# EAGLE design PureRingMod (EAGLE 9.2.0)

## Sheet 1 of 2: Main
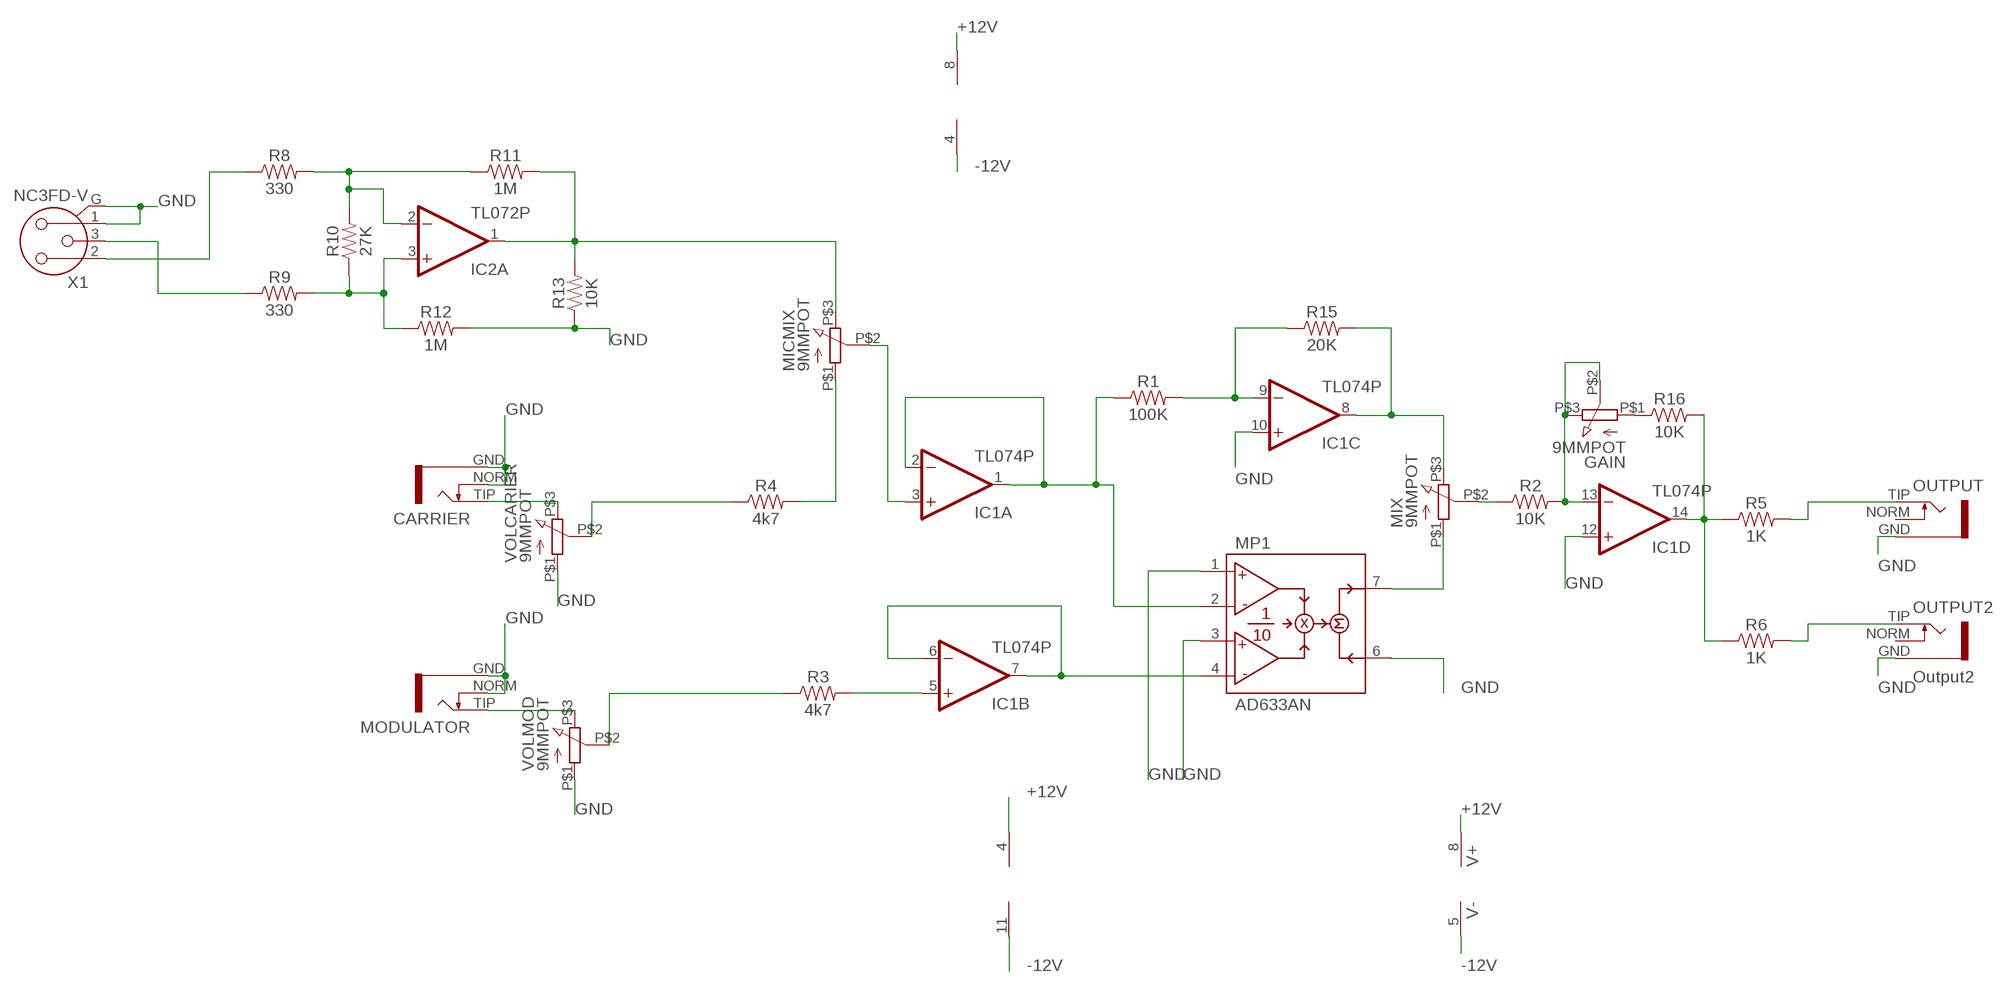
[diagram p0: schematic, sheet 1]

### Parts
CARRIER  S_JACK  [S_JACK]
GAIN  9MMPOT  [POT]
IC1  TL074P  [DIL14]
IC2  TL072P  [DIL08]
MICMIX  9MMPOT  [POT]
MIX  9MMPOT  [POT]
MODULATOR  S_JACK  [S_JACK]
MP1  AD633AN  [DIL08]
OUTPUT  S_JACK  [S_JACK]
OUTPUT2  Output2  S_JACK  [S_JACK]
R1  100K  330OHM-HORIZ-1/10W-5%  [AXIAL-0.3]
R2  10K  330OHM-HORIZ-1/10W-5%  [AXIAL-0.3]
R3  4k7  330OHM-HORIZ-1/10W-5%  [AXIAL-0.3]
R4  4k7  330OHM-HORIZ-1/10W-5%  [AXIAL-0.3]
R5  1K  330OHM-HORIZ-1/10W-5%  [AXIAL-0.3]
R6  1K  330OHM-HORIZ-1/10W-5%  [AXIAL-0.3]
R8  330  330OHM-HORIZ-1/10W-5%  [AXIAL-0.3]
R9  330  330OHM-HORIZ-1/10W-5%  [AXIAL-0.3]
R10  27K  330OHM-HORIZ-1/10W-5%  [AXIAL-0.3]
R11  1M  330OHM-HORIZ-1/10W-5%  [AXIAL-0.3]
R12  1M  330OHM-HORIZ-1/10W-5%  [AXIAL-0.3]
R13  10K  330OHM-HORIZ-1/10W-5%  [AXIAL-0.3]
R15  20K  330OHM-HORIZ-1/10W-5%  [AXIAL-0.3]
R16  10K  330OHM-HORIZ-1/10W-5%  [AXIAL-0.3]
VOLCARIER  9MMPOT  [POT]
VOLMOD  9MMPOT  [POT]
X1  NC3FD-V  [NC3FD-V]

### Nets
+12V [12V]: IC1.4(P:V+) IC2.8(P:V+) MP1.8(V+) ; also sheet 2
-12V [12V]: IC1.11(P:V-) IC2.4(P:V-) MP1.5(V-) ; also sheet 2
GND [Power]: CARRIER.GND CARRIER.NORM IC1.10(C:+IN) IC1.12(D:+IN) MODULATOR.GND MODULATOR.NORM MP1.1(X1) MP1.3(Y1) MP1.6(Z) OUTPUT2.GND OUTPUT.GND R12.P$2 R13.P$1 VOLCARIER.P$1 VOLMOD.P$1 X1.1 X1.G ; also sheet 2
N$1: IC1.1(A:OUT) IC1.2(A:-IN) MP1.2(X2) R1.P$1
N$2: IC1.6(B:-IN) IC1.7(B:OUT) MP1.4(Y2)
N$3: MIX.P$1 MP1.7(W)
N$4: IC1.8(C:OUT) MIX.P$3 R15.P$2
N$5: GAIN.P$1 R16.P$1
N$6: MIX.P$2 R2.P$1
N$7: GAIN.P$2 GAIN.P$3 IC1.13(D:-IN) R2.P$2
N$8: MICMIX.P$1 R4.P$2
N$11: IC1.5(B:+IN) R3.P$2
N$12: IC1.14(D:OUT) R5.P$1 R6.P$1 R16.P$2
N$14: IC1.9(C:-IN) R1.P$2 R15.P$1
N$15: OUTPUT.TIP R5.P$2
N$16: CARRIER.TIP VOLCARIER.P$3
N$17: MODULATOR.TIP VOLMOD.P$3
N$18: R4.P$1 VOLCARIER.P$2
N$19: R3.P$1 VOLMOD.P$2
N$20: OUTPUT2.TIP R6.P$2
N$22: R8.P$1 X1.2
N$23: R9.P$1 X1.3
N$24: IC2.2(A:-IN) R8.P$2 R10.P$2 R11.P$1
N$25: IC2.3(A:+IN) R9.P$2 R10.P$1 R12.P$1
N$27: IC2.1(A:OUT) MICMIX.P$3 R11.P$2 R13.P$2
N$30: IC1.3(A:+IN) MICMIX.P$2
Unconnected: IC2.5(B:+IN) IC2.6(B:-IN) IC2.7(B:OUT) OUTPUT2.NORM OUTPUT.NORM

## Sheet 2 of 2: Power
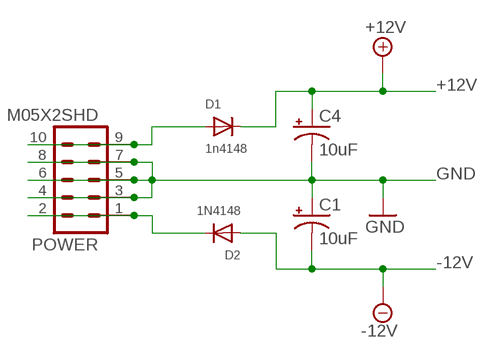
[diagram p1: schematic, sheet 2]

### Parts
C1  10uF  10UF-POLAR-RADIAL-2.5MM-25V-20%  [CPOL-RADIAL-2.5MM-5MM]
C4  10uF  10UF-POLAR-RADIAL-2.5MM-25V-20%  [CPOL-RADIAL-2.5MM-5MM]
D1  1n4148  DIODEDO-1N4148  [DO-1N4148]
D2  1N4148  DIODEDO-1N4148  [DO-1N4148]
POWER  M05X2SHD  [2X5-SHROUDED]

### Nets
+12V [12V]: C4.1(+) D1.C ; also sheet 1
-12V [12V]: C1.2(-) D2.A ; also sheet 1
GND [Power]: C1.1(+) C4.2(-) POWER.3 POWER.4 POWER.5 POWER.6 POWER.7 POWER.8 ; also sheet 1
N$9: D1.A POWER.9 POWER.10
N$10: D2.C POWER.1 POWER.2

## Library data of the parts
C1 C4 = SparkFun-Capacitors:10UF-POLAR: 10.0µF polarized capacitors A capacitor is a passive two-terminal electrical component used to store electrical energy temporarily in an electric field.; PROD_ID: CAP-08440
CARRIER MODULATOR OUTPUT OUTPUT2 = INSTRUO:S_JACK
D1 D2 = adafruit:DIODE: Diode SMADIODE - SMA Surface Mount Package 20V 1A Schottky Diode Digikey: 641-1014-6-ND DO-1N4148 - Through Hole Small Current Diode SOD-123 20V 1 A (.5mV Vf) Schottky Diode - Digikey: MBRX120TPMSCT-ND SOD-323 10V 570mA (.38mV Vf, 3ns) Schottky Diode - Digikey: ZLLS410CT-ND SOD-523 30V 30mA Schottky Diode (RB751S-40TE61) - Digikey: RB751S-40TE61CT-ND SOT23-R/W - SOT23 Package (R = Solder Paste/Reflow Ovens, W = Hand-Soldering) BAT54Film 40V 300mA - Digikey: 497-7162-1-ND
GAIN MICMIX MIX VOLCARIER VOLMOD = GMSN:9MMPOT
IC1 = GMSN:TL074: OP AMP
IC2 = GMSN-R2Project:TL072: OP AMP
MP1 = ad633-2:AD633*
POWER = SparkFun-Connectors:M05X2: Header 5x2 Standard 10-pin dual row 0.1" header. Commonly used with AVR-ISP. Use with Spark Fun Electronics SKU: PRT-00778
R1-R6 R10-R13 R15 R16 = SparkFun-Resistors:330OHM: 330Ω resistor A resistor is a passive two-terminal electrical component that implements electrical resistance as a circuit element. Resistors act to reduce current flow, and, at the same time, act to lower voltage levels within circuits. - Wikipedia; PROD_ID: RES-8371; VALUE: 330
R8 R9 = SparkFun-Resistors:330OHM: 330Ω resistor A resistor is a passive two-terminal electrical component that implements electrical resistance as a circuit element. Resistors act to reduce current flow, and, at the same time, act to lower voltage levels within circuits. - Wikipedia; PROD_ID: RES-8371
X1 = con-neutrik_ag:NC3: Neutrik Audio Connector XLR SERIES Stereo 1/4" jack Source: www.neutrik.com/; MF: FARNELL; MPN: NC3FDV; OC_FARNELL: 308869; OC_NEWARK: 07WX7308; RS-PART: 448-244

## Net classes
1 Power: width 0.35 mm
2 12V: width 0.6 mm

## Board
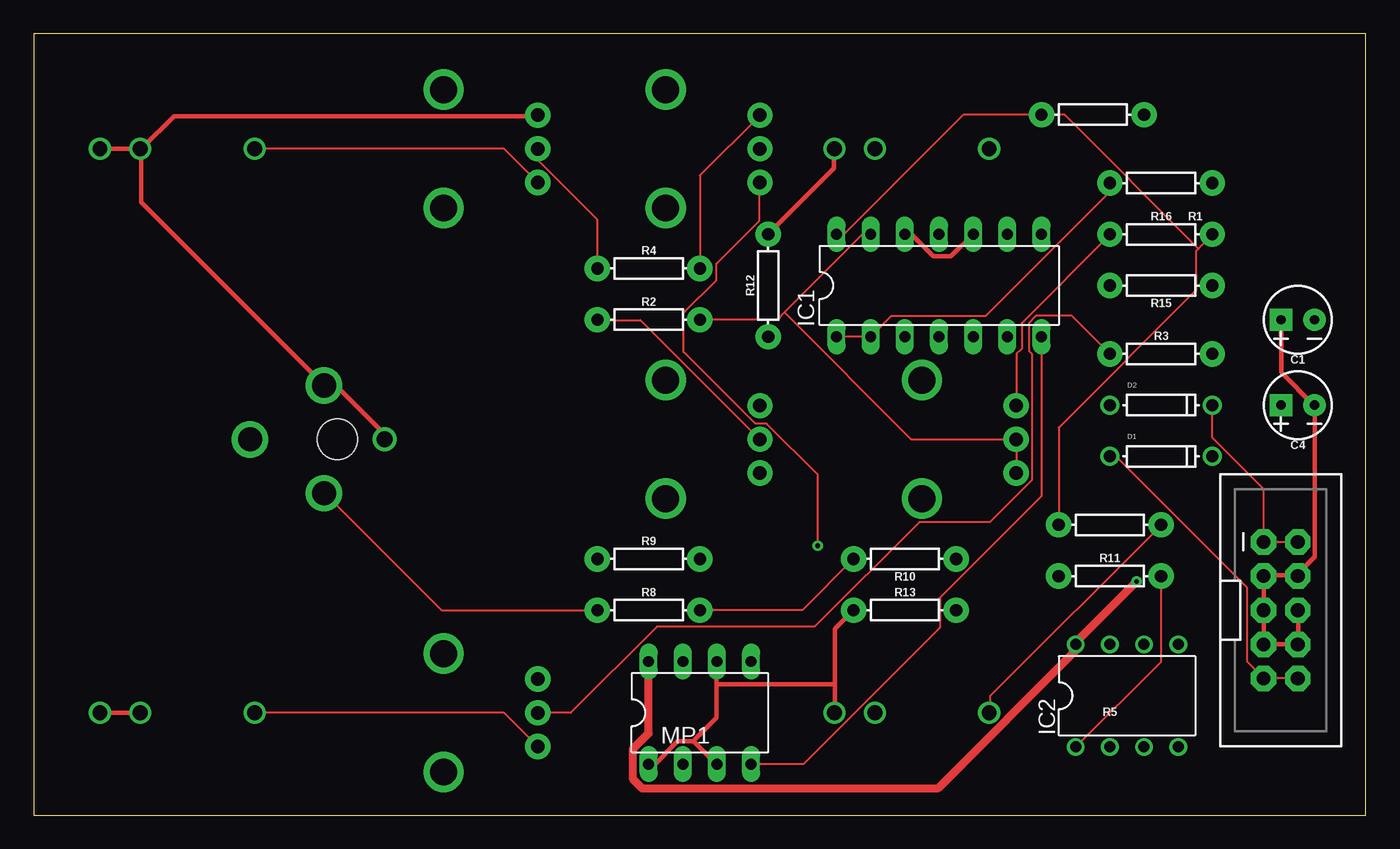
[diagram p2: board, top side]
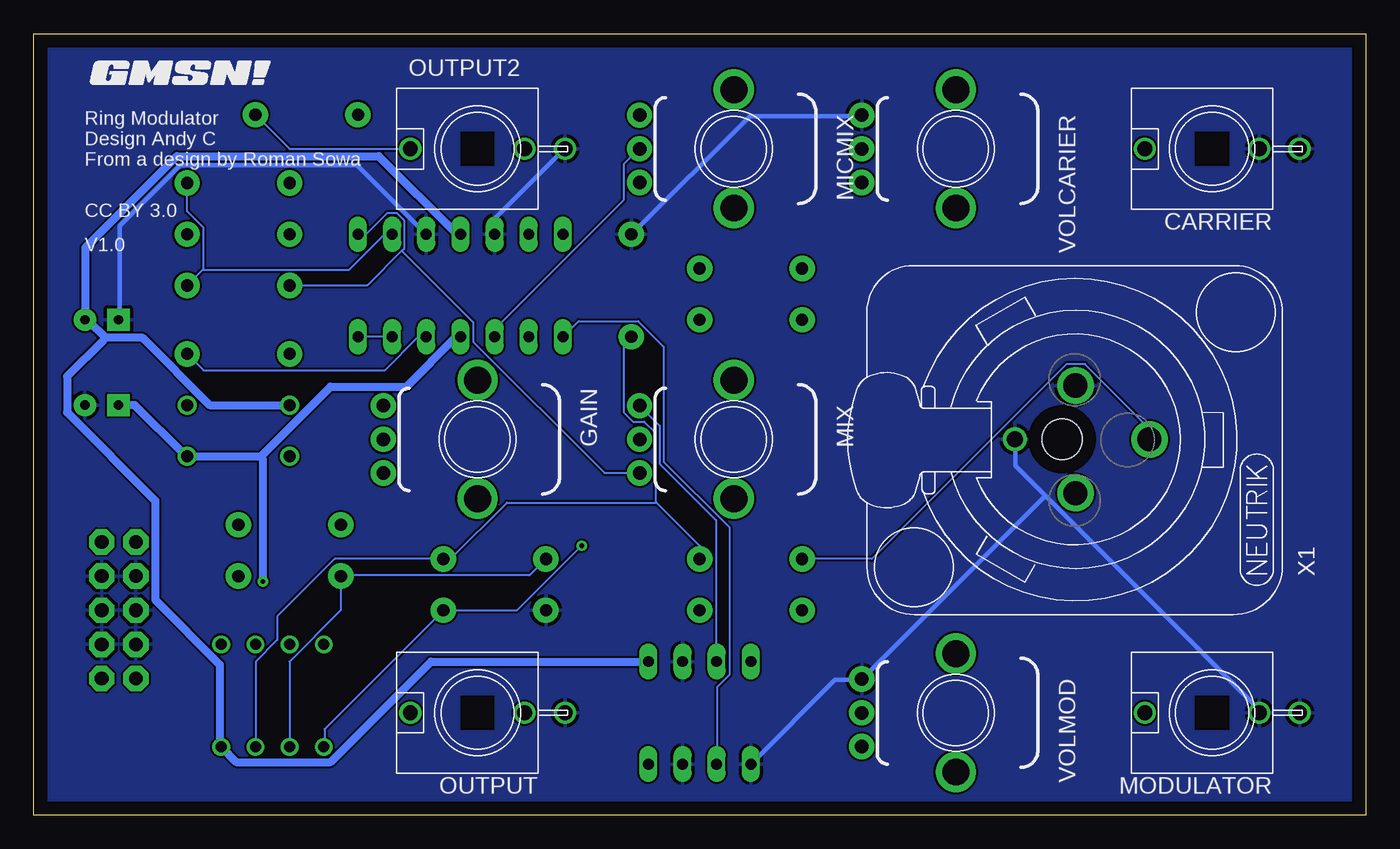
[diagram p3: board, bottom side, seen from below]

Size 99.04 x 58.09 mm. Coordinates in mm from the lower left corner, seen from the top.
Outline: 0,0 99.04,0 99.04,58.09 0,58.09 0,0
Copper layers (1*16): Top 0.035mm / dielectric 1.5mm / Bottom 0.035mm
Design rules "default": minimum track width 6mil, minimum drill 0.35mm, track to track 6mil, track to pad 6mil, pad to pad 6mil, via to via 6mil, smd to smd 6mil, copper to edge 40mil, drill to drill 6mil, minimum pad ring 10mil, minimum via ring 8mil, stop-mask expansion 4mil, vias tented up to drill 0mil, thermal gap 10mil

### Footprints (pad centres in the part's own frame; a part is rotated, then mirrored left to right if it is on the bottom)
CPOL-RADIAL-2.5MM-5MM = drill 0.7 pad 1.651 square: 1 1.25,0 | drill 0.7 pad 1.651: 2 -1.25,0
S_JACK = drill 1.1: GND 0,-6.5; NORM 0,-3.5; TIP 0,5
DO-1N4148 = drill 0.9: A -3.81,0; C 3.81,0
POT = drill 1 pad 1.88: P$1 -2.5,-7; P$2 0,-7; P$3 2.5,-7 | drill 2 pad 2.68: P$4 -4.4,0; P$5 4.4,0
DIL14 = drill 0.813 long: 1 -7.62,-3.81; 2 -5.08,-3.81; 3 -2.54,-3.81; 4 0,-3.81; 5 2.54,-3.81; 6 5.08,-3.81; 7 7.62,-3.81; 8 7.62,3.81; 9 5.08,3.81; 10 2.54,3.81; 11 0,3.81; 12 -2.54,3.81; 13 -5.08,3.81; 14 -7.62,3.81
DIL08 = drill 0.813 pad 1.27: 1 -3.81,-3.81; 2 -1.27,-3.81; 3 1.27,-3.81; 4 3.81,-3.81; 5 3.81,3.81; 6 1.27,3.81; 7 -1.27,3.81; 8 -3.81,3.81
DIL08' = drill 0.813 long: 1 -3.81,-3.81; 2 -1.27,-3.81; 3 1.27,-3.81; 4 3.81,-3.81; 5 3.81,3.81; 6 1.27,3.81; 7 -1.27,3.81; 8 -3.81,3.81
2X5-SHROUDED = drill 1.016 pad 1.88 octagon: 1 -1.27,5.08; 2 1.27,5.08; 3 -1.27,2.54; 4 1.27,2.54; 5 -1.27,0; 6 1.27,0; 7 -1.27,-2.54; 8 1.27,-2.54; 9 -1.27,-5.08; 10 1.27,-5.08
AXIAL-0.3 = drill 0.9 pad 1.88: P$1 -3.81,0; P$2 3.81,0
NC3FD-V = drill 1.8: 1 4,0; 2 -4,0; 3 0,-5.5 | drill 1.2: G 0,4.5 | hole 3: 0,1

### Placement (x,y rotation side)
C1  93.98,36.83 180 top
C4  93.98,30.48 180 top
CARRIER  11.43,49.53 90 bottom
D1  [DO-1N4148]  83.82,26.67 0 top
D2  [DO-1N4148]  83.82,30.48 0 top
GAIN  66.04,27.94 270 bottom
IC1  67.31,39.37 0 top
IC2  81.28,8.89 0 top
MICMIX  46.99,49.53 270 bottom
MIX  46.99,27.94 270 bottom
MODULATOR  11.43,7.62 90 bottom
MP1  AD633AN  [DIL08']  49.53,7.62 0 top
OUTPUT  66.04,7.62 90 bottom
OUTPUT2  66.04,49.53 90 bottom
POWER  92.71,15.24 0 top
R1  83.82,46.99 0 top
R2  45.72,36.83 0 top
R3  83.82,34.29 0 top
R4  45.72,40.64 0 top
R5  80.01,21.59 0 top
R6  78.74,52.07 0 top
R8  45.72,15.24 0 top
R9  45.72,19.05 0 top
R10  64.77,19.05 180 top
R11  80.01,17.78 0 top
R12  54.61,39.37 90 top
R13  64.77,15.24 0 top
R15  83.82,39.37 180 top
R16  83.82,43.18 0 top
U$2  [GMSN!_LOGO]  87.86,55.09 0 bottom
VOLCARIER  30.48,49.53 270 bottom
VOLMOD  30.48,7.62 270 bottom
X1  21.59,27.94 90 bottom

### Tracks (layer width: path | path; a pad name or v marks a point on that pad's centre or on a via)
+12V  (via drill 0.35)
  Top 0.6: MP1.8 45.72,6.1 44.58,4.95 44.58,2.67 45.26,1.98 67.21,1.98 77.42,12.19 77.42,12.65 IC2.8 77.57,12.95 v81.99,17.37
  Bottom 0.6: 82.14,26.67 76.96,31.85 71.32,31.85 67.67,35.51 67.36,35.51 IC1.4 | 82.14,26.67 D1.C 87.86,26.82 91.52,30.48 C4.1 | v81.99,17.37 81.99,26.44 82.14,26.67
-12V
  Bottom 0.6: MP1.5 69.49,11.43 76.96,3.96 83.97,3.96 IC2.4 85.19,5.33 85.19,11.2 89.99,16 89.99,23.39 96.55,29.95 96.55,32.61 93.88,35.28 93.73,35.51 | IC1.11 67.36,43.2 67.59,43.2 73.38,49 88.39,49 95.17,42.22 95.17,36.88 C1.2 94.94,36.73 93.73,35.51 | D2.A 85.95,30.48 90.98,35.51 93.73,35.51
GND
  Top 0.35: C1.1 92.73,36.8 92.73,32.92 95.17,30.48 C4.2 95.25,30.33 95.25,19.2 94.03,17.98 POWER.4 93.95,17.83 91.59,17.83 POWER.3 POWER.5 POWER.7 91.59,12.72 93.95,12.72 POWER.8 94.03,12.88 94.03,15.24 POWER.6 | IC1.10 68.2,41.53 66.9,41.53 65.3,43.13 64.77,43.13 IC1.12 | R12.P$2 59.51,48.08 59.51,49.53 OUTPUT2.GND | 59.59,9.75 59.59,13.87 R13.P$1 | 59.59,9.75 59.59,7.62 OUTPUT.GND | MP1.1 46.18,3.81 47.85,5.49 49.07,5.49 | 49.07,5.49 50.75,3.81 MP1.3 | 50.75,9.75 50.75,7.24 49.15,5.64 49.07,5.49 | 50.75,9.75 50.75,11.43 MP1.6 | 50.75,9.75 59.59,9.75 | CARRIER.NORM CARRIER.GND | MODULATOR.NORM MODULATOR.GND | X1.G 26.06,27.96 26.06,28.35 22.48,31.93 21.64,31.93 X1.1 21.49,32.08 8,45.57 8,49.38 CARRIER.NORM | VOLCARIER.P$1 37.41,51.97 10.44,51.97 8.08,49.61 CARRIER.NORM
  Bottom 0.35: VOLCARIER.P$1 37.49,51.97 45.8,51.97 54.56,43.2 R12.P$2 | IC1.12 64.77,44.35 59.59,49.53 OUTPUT2.GND | IC1.10 74.98,48.31 88.16,48.31 92.66,43.81 92.66,36.88 C1.1 | MP1.1 39.47,10.06 37.49,10.06 VOLMOD.P$1 37.34,10.21 23.81,23.74 | 23.81,23.74 26.06,25.98 26.06,27.89 X1.G | 23.81,23.74 8,7.92 8,7.62 MODULATOR.NORM
  pour Bottom: 0,58.42 99.06,58.42 99.06,0 0,0
N$1
  Top 0.152: IC1.1 59.74,35.59 62.18,35.59 IC1.2 63.78,37.11 70.79,37.11 80.01,46.33 R1.P$1
  Bottom 0.152: IC1.1 58.52,36.73 54.1,36.73 52.2,34.82 52.2,26.29 47.32,21.41 47.32,10.44 48.23,9.53 48.23,3.81 MP1.2
N$2
  Top 0.152: MP1.4 57.23,3.81 67.36,13.95 67.36,16.15 74.91,23.7 74.91,35.51 IC1.7
  Bottom 0.152: IC1.6 72.39,35.59 74.91,35.59 IC1.7
N$3
  Bottom 0.152: MP1.7 48.31,11.43 48.31,21.95 52.5,26.14 52.5,28.96 53.95,30.4 MIX.P$1
N$4
  Bottom 0.152: 71.67,41.95 74.22,39.4 80.01,39.4 R15.P$2 | 71.67,41.95 71.48,42.14 71.48,44.2 72.01,44.73 72.77,44.73 74.3,43.2 74.91,43.2 IC1.8 | 71.67,41.95 66.37,36.65 66.37,35.2 56.62,25.45 54.03,25.45 MIX.P$3
N$5
  Top 0.152: GAIN.P$1 73.08,30.48 73.08,34.29 73.46,34.67 73.46,36.58 80.01,43.13 R16.P$1
N$6
  Top 0.152: MIX.P$2 53.95,27.96 45.11,36.8 41.91,36.8 R2.P$1
N$7
  Top 0.152: GAIN.P$3 73.08,25.45 73.08,27.89 GAIN.P$2 73,27.96 65.23,27.96 55.82,37.38 | 55.82,37.38 55.32,36.88 49.53,36.88 R2.P$2 | 55.82,37.38 61.57,43.13 62.18,43.13 IC1.13
N$8
  Top 0.152: R4.P$2 49.53,47.55 53.95,51.97 MICMIX.P$1
N$9
  Top 0.152: D1.A 80.47,26.67 90.22,16.92 90.22,11.43 91.44,10.21 | 91.44,10.21 93.95,10.21 POWER.10 | 91.44,10.21 POWER.9
N$10
  Top 0.152: D2.C 87.63,28.04 91.44,24.23 91.44,20.34 | 91.44,20.34 93.95,20.34 POWER.2 | 91.44,20.34 POWER.1
N$11
  Bottom 0.152: R3.P$2 86.41,33.07 72.92,33.07 70.48,35.51 69.88,35.51 IC1.5
N$12
  Top 0.152: IC1.14 59.74,43.2 60.27,43.2 69.11,52.05 74.91,52.05 R6.P$1 74.98,52.05 76.66,52.05 86.6,42.1 | R5.P$1 76.2,28.8 86.41,39.01 86.41,41.91 86.6,42.1 | 86.6,42.1 87.63,43.13 R16.P$2
N$14
  Bottom 0.152: 86.41,40.54 86.49,40.54 87.63,39.4 R15.P$1 | 86.41,40.54 75.59,40.54 73,43.13 72.39,43.13 IC1.9 | R1.P$2 87.63,44.88 86.41,43.66 86.41,40.54
N$15
  Top 0.152: OUTPUT.TIP 71.09,7.62 71.09,8.84 83.82,21.57 R5.P$2
N$16
  Top 0.152: CARRIER.TIP 34.98,49.53 37.41,47.09 VOLCARIER.P$3
N$17
  Top 0.152: MODULATOR.TIP 34.98,7.62 37.41,5.18 VOLMOD.P$3
N$18
  Top 0.152: R4.P$1 41.91,44.27 37.49,48.69 VOLCARIER.P$2
N$19
  Top 0.152: VOLMOD.P$2 39.93,7.62 46.33,14.02 58.06,14.02 65.84,21.79 71.09,21.79 74.22,24.92 74.22,34.29 73.99,34.52 73.99,36.58 74.52,37.11 77.19,37.11 R3.P$1
N$20
  Bottom 0.152: OUTPUT2.TIP 80.01,49.53 R6.P$2
N$22
  Top 0.152: R8.P$1 30.33,15.24 21.64,23.93 X1.2
N$23
  Bottom 0.152: R9.P$1 36.73,19.05 22.25,33.53 20.88,33.53 16.15,28.8 16.15,27.96 X1.3
N$24
  Top 0.152: R8.P$2 57.15,15.24 R10.P$2
  Bottom 0.152: IC2.2 80.01,11.43 76.2,15.24 R11.P$1 76.2,17.83 62.18,17.83 R10.P$2
N$25
  Bottom 0.152: R9.P$2 49.53,20.04 52.77,23.28 | 52.77,23.28 52.81,23.32 52.81,28.42 53.65,29.26 54.48,29.26 55.17,29.95 55.17,34.98 54.63,35.51 R12.P$1 | IC2.3 82.53,5.11 82.53,11.43 80.92,13.03 80.92,14.78 76.66,19.05 R10.P$1 68.05,19.05 63.86,23.24 52.81,23.24 52.77,23.28
N$27  (via drill 0.35)
  Top 0.152: v58.29,20.04 58.29,25.3 54.48,29.11 53.65,29.11 48.31,34.44 48.31,37.34 50.75,39.78 50.75,41 53.95,44.2 53.95,47.02 MICMIX.P$3 | R11.P$2 83.82,11.43 IC2.1
  Bottom 0.152: IC2.1 77.42,5.11 77.42,6.4 R13.P$2 63.09,15.24 v58.29,20.04
N$30
  Bottom 0.152: IC1.3 64.77,36.12 55.17,45.72 55.17,48.39 54.03,49.53 MICMIX.P$2

### Text on the board
bNames: Ring Modulator / Design Andy C / From a design by Roman Sowa | CC BY 3.0 | V1.0